# EasyEDA schematic GeneBird_ESP_8266_Schmatic.json
TITLE: GeneBird; REV: 1.0; Date: 2020-09-29; Sheet: 1/1; Drawn By: Noor haq; Company: UET
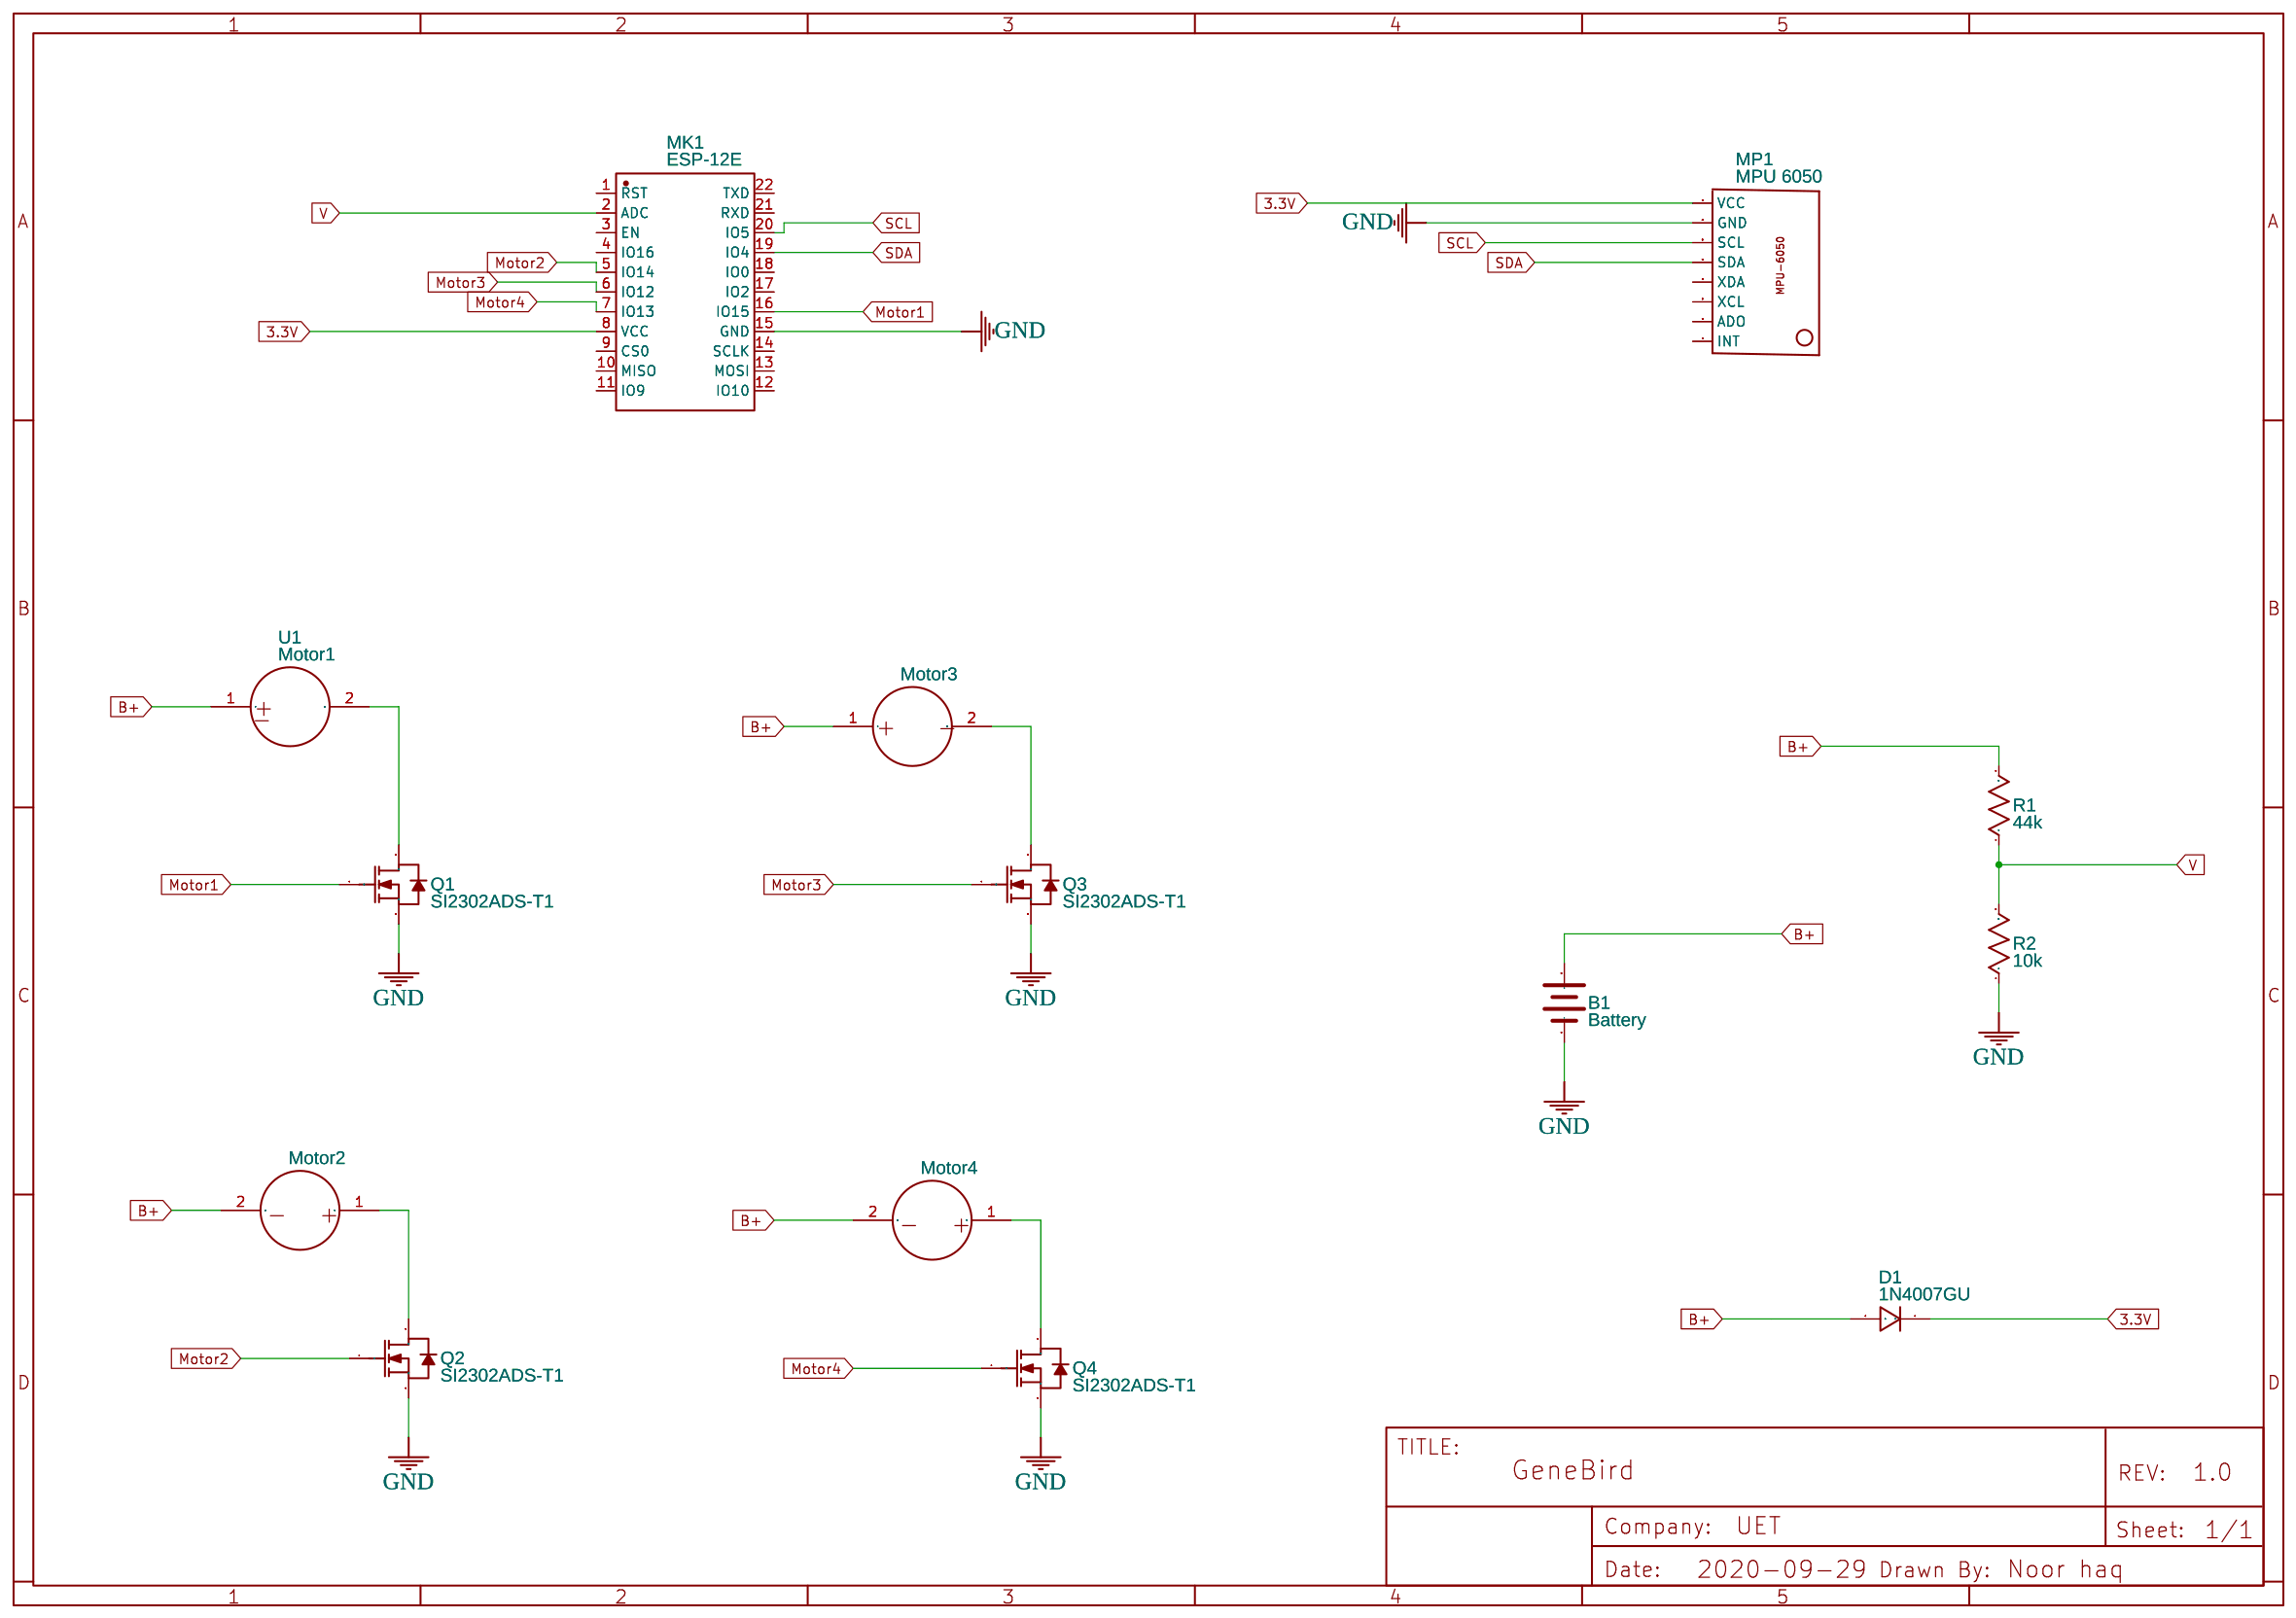
[diagram p0: schematic sheet]

## Parts
B1  Battery  [BATTERYPAD]
D1  1N4007GU  [DO-41_BD2.4-L4.7-P8.70-D0.9-RD]
MK1  ESP-12E  [ESP8266-12E]
MP1  MPU 6050  [MPU 6050]
Q1  SI2302ADS-T1  [SOT-23-3_L2.9-W1.3-P1.90-LS2.4-BR]
Q2  SI2302ADS-T1  [SOT-23-3_L2.9-W1.3-P1.90-LS2.4-BR]
Q3  SI2302ADS-T1  [SOT-23-3_L2.9-W1.3-P1.90-LS2.4-BR]
Q4  SI2302ADS-T1  [SOT-23-3_L2.9-W1.3-P1.90-LS2.4-BR]
R1  44k  [RESISTOR]
R2  10k  [RESISTOR]
U1  Motor1  [TWO WIRE HOLES 5MM SPACING]
U2  Motor2  [TWO WIRE HOLES 5MM SPACING]
U3  Motor3  [TWO WIRE HOLES 5MM SPACING]
U4  Motor4  [TWO WIRE HOLES 5MM SPACING]

## Library data of the parts
B1 = Battery: Supplier Part: undefined; Contributor: mitch.tiongson_5583
D1 = 1N4007GU: Supplier: LCSC; Supplier Part: C189226; Manufacturer: DIYI Elec Tech; Contributor: LCSC
MK1 = ESP-12E: Supplier: LCSC; Manufacturer: Ai-Thinker; Supplier Part: C89297
MP1 = MPU 6050: Contributor: waltertayler
Q1-Q4 = SI2302ADS-T1: Supplier: LCSC; Supplier Part: C725156; Manufacturer: VBsemi Elec; Contributor: LCSC
R1 R2 = R_0603_US: Contributor: LCEDA_Lib
U1 U2 U4 = TWO WIRE HOLES 5MM SPACING: Contributor: samgurdus; Package Display: No
U3 = TWO WIRE HOLES 5MM SPACING: Contributor: samgurdus

## Nets
3.3V: D1.1 MK1.8(VCC) MP1.VCC
GND: B1.-VE(-) MK1.15(GND) MP1.GND Q1.2(S) Q2.2(S) Q3.2(S) Q4.2(S) R2.1
B+: B1.+VE(+) D1.2 R1.2 U1.1 U2.2 U3.1 U4.2
Motor1: MK1.16(IO15) Q1.1(G)
Motor2: MK1.5(IO14) Q2.1(G)
Motor3: MK1.6(IO12) Q3.1(G)
Motor4: MK1.7(IO13) Q4.1(G)
SCL: MK1.20(IO5) MP1.SCL
SDA: MK1.19(IO4) MP1.SDA
V: MK1.2(ADC) R1.1 R2.2
Net-(Q1-3): Q1.3(D) U1.2
Net-(Q2-3): Q2.3(D) U2.1
Net-(Q3-3): Q3.3(D) U3.2
Net-(Q4-3): Q4.3(D) U4.1

Not connected (* = marked no-connect by the designer): MK1 1(RST) 3(EN) 4(IO16) 9(CS0) 10(MISO) 11(IO9) 12(IO10) 13(MOSI) 14(SCLK) 17(IO2) 18(IO0) 21(RXD) 22(TXD); MP1 ADO INT XCL XDA
